# Altium schematic sheet VS_cs.SchDoc
size 420 x 297 mm; Address1: Address1; Address2: Address2; Address3: Address3; Address4: Address4; DocumentNumber: АБВГ.123456.001 Э3; SheetNumber: 2; Scale: 1:1; DocumentType: Схема электрическая принципиальная; FirstReferrence: АБВГ.123456.001
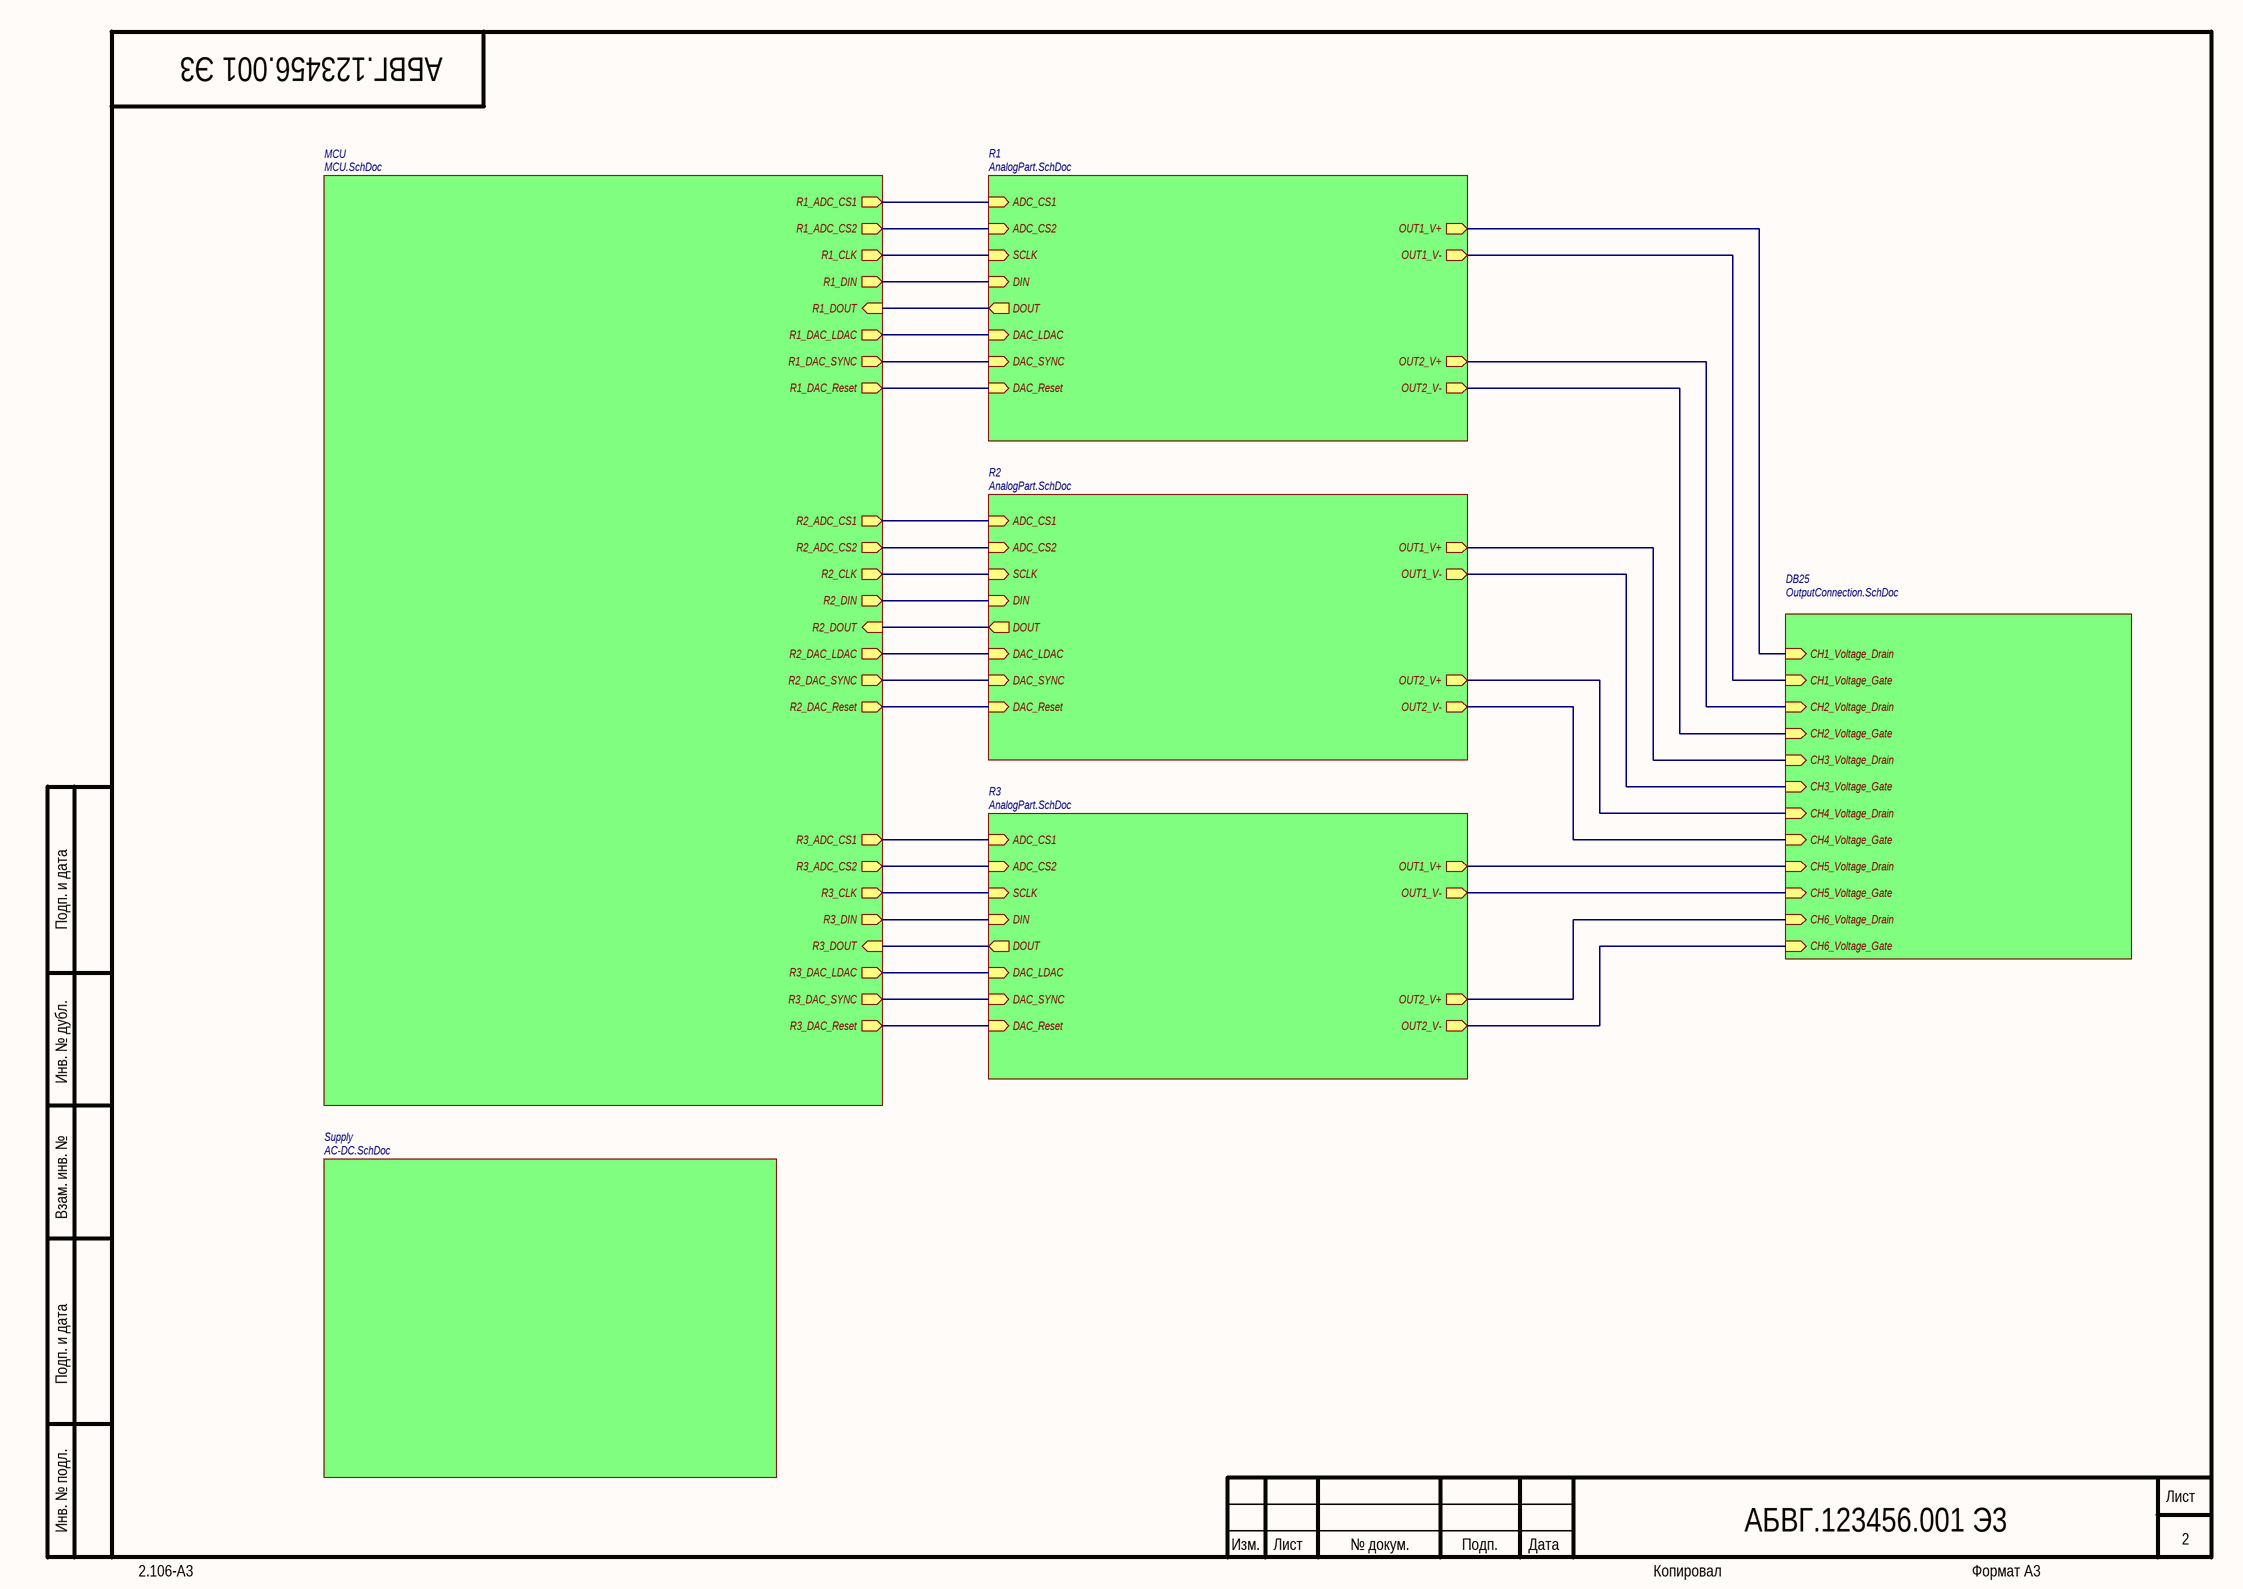
[diagram p0: VS_cs.SchDoc]

## Sub-sheets
DB25 = OutputConnection.SchDoc: CH1_Voltage_Drain (in), CH2_Voltage_Drain (in), CH3_Voltage_Drain (in), CH4_Voltage_Drain (in), CH5_Voltage_Drain (in), CH1_Voltage_Gate (in), CH2_Voltage_Gate (in), CH3_Voltage_Gate (in), CH4_Voltage_Gate (in), CH5_Voltage_Gate (in), CH6_Voltage_Drain (in), CH6_Voltage_Gate (in)
MCU = MCU.SchDoc: R1_ADC_CS1 (out), R1_CLK (out), R1_DIN (out), R1_DOUT (in), R1_DAC_LDAC (out), R1_DAC_SYNC (out), R1_DAC_Reset (out), R1_ADC_CS2 (out), R2_ADC_CS1 (out), R2_CLK (out), R2_DIN (out), R2_DOUT (in), R2_DAC_LDAC (out), R2_DAC_SYNC (out), R2_DAC_Reset (out), R2_ADC_CS2 (out), R3_ADC_CS1 (out), R3_CLK (out), R3_DIN (out), R3_DOUT (in), R3_DAC_LDAC (out), R3_DAC_SYNC (out), R3_DAC_Reset (out), R3_ADC_CS2 (out)
R1 = AnalogPart.SchDoc: ADC_CS1 (in), SCLK (in), DIN (in), DOUT (out), DAC_LDAC (in), DAC_SYNC (in), DAC_Reset (in), ADC_CS2 (in), OUT1_V+ (out), OUT1_V- (out), OUT2_V+ (out), OUT2_V- (out)
R2 = AnalogPart.SchDoc: ADC_CS1 (in), SCLK (in), DIN (in), DOUT (out), DAC_LDAC (in), DAC_SYNC (in), DAC_Reset (in), ADC_CS2 (in), OUT1_V+ (out), OUT1_V- (out), OUT2_V+ (out), OUT2_V- (out)
R3 = AnalogPart.SchDoc: ADC_CS1 (in), SCLK (in), DIN (in), DOUT (out), DAC_LDAC (in), DAC_SYNC (in), DAC_Reset (in), ADC_CS2 (in), OUT1_V+ (out), OUT1_V- (out), OUT2_V+ (out), OUT2_V- (out)
Supply = AC-DC.SchDoc: no entries

## Nets
(unnamed): sheet DB25/CH1_Voltage_Drain, sheet R1/OUT1_V+
(unnamed): sheet DB25/CH2_Voltage_Drain, sheet R1/OUT2_V+
(unnamed): sheet DB25/CH3_Voltage_Drain, sheet R2/OUT1_V+
(unnamed): sheet DB25/CH4_Voltage_Drain, sheet R2/OUT2_V+
(unnamed): sheet DB25/CH5_Voltage_Drain, sheet R3/OUT1_V+
(unnamed): sheet DB25/CH1_Voltage_Gate, sheet R1/OUT1_V-
(unnamed): sheet DB25/CH2_Voltage_Gate, sheet R1/OUT2_V-
(unnamed): sheet DB25/CH3_Voltage_Gate, sheet R2/OUT1_V-
(unnamed): sheet DB25/CH4_Voltage_Gate, sheet R2/OUT2_V-
(unnamed): sheet DB25/CH5_Voltage_Gate, sheet R3/OUT1_V-
(unnamed): sheet DB25/CH6_Voltage_Drain, sheet R3/OUT2_V+
(unnamed): sheet DB25/CH6_Voltage_Gate, sheet R3/OUT2_V-
(unnamed): sheet MCU/R1_ADC_CS1, sheet R1/ADC_CS1
(unnamed): sheet MCU/R1_CLK, sheet R1/SCLK
(unnamed): sheet MCU/R1_DIN, sheet R1/DIN
(unnamed): sheet MCU/R1_DOUT, sheet R1/DOUT
(unnamed): sheet MCU/R1_DAC_LDAC, sheet R1/DAC_LDAC
(unnamed): sheet MCU/R1_DAC_SYNC, sheet R1/DAC_SYNC
(unnamed): sheet MCU/R1_DAC_Reset, sheet R1/DAC_Reset
(unnamed): sheet MCU/R1_ADC_CS2, sheet R1/ADC_CS2
(unnamed): sheet MCU/R2_ADC_CS1, sheet R2/ADC_CS1
(unnamed): sheet MCU/R2_CLK, sheet R2/SCLK
(unnamed): sheet MCU/R2_DIN, sheet R2/DIN
(unnamed): sheet MCU/R2_DOUT, sheet R2/DOUT
(unnamed): sheet MCU/R2_DAC_LDAC, sheet R2/DAC_LDAC
(unnamed): sheet MCU/R2_DAC_SYNC, sheet R2/DAC_SYNC
(unnamed): sheet MCU/R2_DAC_Reset, sheet R2/DAC_Reset
(unnamed): sheet MCU/R2_ADC_CS2, sheet R2/ADC_CS2
(unnamed): sheet MCU/R3_ADC_CS1, sheet R3/ADC_CS1
(unnamed): sheet MCU/R3_CLK, sheet R3/SCLK
(unnamed): sheet MCU/R3_DIN, sheet R3/DIN
(unnamed): sheet MCU/R3_DOUT, sheet R3/DOUT
(unnamed): sheet MCU/R3_DAC_LDAC, sheet R3/DAC_LDAC
(unnamed): sheet MCU/R3_DAC_SYNC, sheet R3/DAC_SYNC
(unnamed): sheet MCU/R3_DAC_Reset, sheet R3/DAC_Reset
(unnamed): sheet MCU/R3_ADC_CS2, sheet R3/ADC_CS2

## Notes on the sheet
- Подп. и дата
- Инв. № дубл.
- Взам. инв. №
- Инв. № подл.
- Изм.
- Лист
- № докум.
- Подп.
- Дата
- 2.106-A3
- Копировал
- Формат А3